# Altium schematic sheet 01_SOC.SchDoc
size 297 x 209 mm; SheetNumber: 1; SheetTotal: 5; Page Create Date: March  8, 1995; Page Number: 1; Page Size: A4; Reviewer: Default; Page Count: 5; Designer: Dennis; Page Name: 01_SOC; RevCode: 1.0; DsnPath: H:\PCB\2026\狼王傻波一\20260204_V0_ELRS-RX\ELRS-RX-MODULE-V11\ELRS-RX-MODULE-V11-20260127.DSN; SchematicName: SCHEMATIC1; PageName: 01_SOC; PageSize: A4; TopSchematic: True
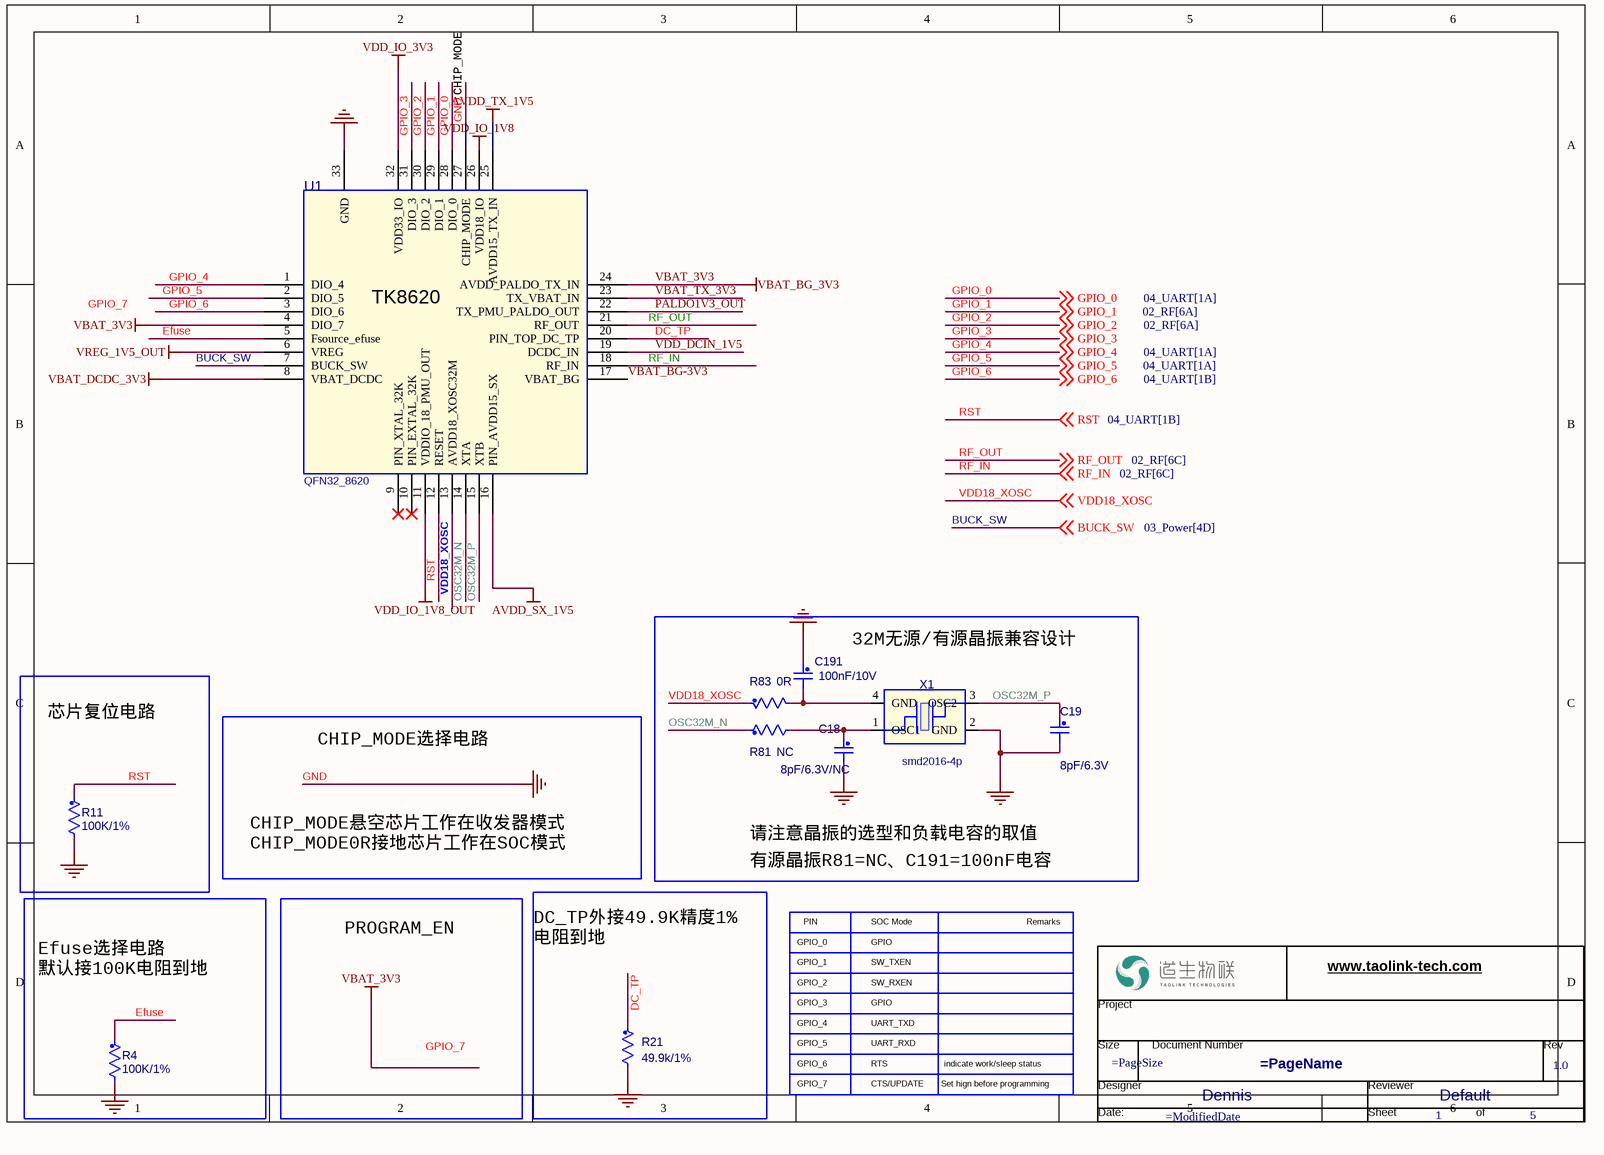
[diagram p0: 01_SOC.SchDoc]

## Parts
*  RevCode: 1.0  Designer: Dennis  Reviewer: Default  Page Number: 1  Page Count: 5  (graphical)
C18  8pF/6.3V/NC  [0201]
C19  8pF/6.3V  [0201]
C191  100nF/10V  [0201]
R4  100K/1%  [0201]
R11  100K/1%  [0201]
R21  49.9k/1%  [0201]
R81  NC  [0201]
R83  0R  [0201]
U1  TK8620  [QFN32_8620]
X1  X1E0002510059  [smd2016-4p]  (value not drawn)

## Blocks framed on the sheet
芯片复位电路: R11

## Nets
AVDD_SX_1V5: U1.16(PIN_AVDD15_SX)
AVDD_TX_1V5: U1.25(AVDD15_TX_IN)
GND: C18.2 C19.2 C191.1 R4.2 R11.2 R21.2 U1.27(CHIP_MODE) U1.33(GND) X1.2(GND)
VBAT_3V3: U1.4(DIO_7) U1.24(AVDD_PALDO_TX_IN)  [also labelled VBAT_BG_3V3]
VBAT_DCDC_3V3: U1.8(VBAT_DCDC)
VDD_IO_1V8: U1.26(VDD18_IO)
VDD_IO_1V8_OUT: U1.11(VDDIO_18_PMU_OUT)
VDD_IO_3V3: U1.32(VDD33_IO)
VREG_1V5_OUT: U1.6(VREG)
BUCK_SW: U1.7(BUCK_SW) ; off-sheet BUCK_SW
DC_TP: R21.1 U1.20(PIN_TOP_DC_TP)
Efuse: R4.1 U1.5(Fsource_efuse)
GPIO_0: U1.28(DIO_0) ; off-sheet GPIO_0
GPIO_1: U1.29(DIO_1) ; off-sheet GPIO_1
GPIO_2: U1.30(DIO_2) ; off-sheet GPIO_2
GPIO_3: U1.31(DIO_3) ; off-sheet GPIO_3
GPIO_4: U1.1(DIO_4) ; off-sheet GPIO_4
GPIO_5: U1.2(DIO_5) ; off-sheet GPIO_5
GPIO_6: U1.3(DIO_6) ; off-sheet GPIO_6
OSC32M_N: R81.1 U1.14(XTA)
OSC32M_P: C19.1 U1.15(XTB) X1.3(OSC2)
PALDO1V3_OUT: U1.22(TX_PMU_PALDO_OUT)
RF_IN: U1.18(RF_IN) ; off-sheet RF_IN
RF_OUT: U1.21(RF_OUT) ; off-sheet RF_OUT
RST: R11.1 U1.12(RESET) ; off-sheet RST
VBAT_BG-3V3: U1.17(VBAT_BG)
VBAT_TX_3V3: U1.23(TX_VBAT_IN)
VDD18_XOSC: R83.1 U1.13(AVDD18_XOSC32M) ; off-sheet VDD18_XOSC
VDD_DCIN_1V5: U1.19(DCDC_IN)
NetC18_1: C18.1 R81.2 X1.1(OSC1)
NetC191_2: C191.2 R83.2 X1.4(GND)

Not connected (* = marked no-connect by the designer): U1 9(PIN_XTAL_32K)* 10(PIN_EXTAL_32K)*

## Notes on the sheet
- CHIP_MODE
- 32M无源/有源晶振兼容设计
- CHIP_MODE选择电路
- CHIP_MODE悬空芯片工作在收发器模式
  CHIP_MODE0R接地芯片工作在SOC模式
- 请注意晶振的选型和负载电容的取值
- 有源晶振R81=NC、C191=100nF电容
- PROGRAM_EN
- DC_TP外接49.9K精度1%
  电阻到地
- GPIO_0
- PIN
- SOC Mode
- GPIO
- (near *) Remarks
- Efuse选择电路
  默认接100K电阻到地
- GPIO_1
- GPIO_2
- GPIO_3
- SW_RXEN
- SW_TXEN
- GPIO_4
- GPIO_5
- GPIO_6
- RTS
- UART_TXD
- UART_RXD
- indicate work/sleep status
- GPIO_7
- CTS/UPDATE
- Set hign before programming
- Labels drawn without touching a wire or pin: GPIO_7
- (in symbol TaoLin_DesignName) www.taolink-tech.com; Project; Size; Document Number; Rev; Designer; Reviewer; Date:; Sheet; of

## Library data of the parts
* = TaoLin_DesignName: Page Create Date: March  8, 1995; Page Size: =PageSize; Page Name: =PageName; Page Modify Date: =ModifiedDate
C18 = Ceramic Capacitor: Ceramic Capacitor,22uF,6.3V,+/-20%,X5R,0603,Samsung; Part Reference: C18; Manufacturer P/N: CL10A226MQ8NRNC; Myir P/N: 20401.00086; Value: 8pF/6.3V/NC; PCB Footprint: 0201; Datasheet: Samsung.pdf; Reserve Value: 22uF; Manufacturer: Samsung; Part Type: Ceramic Capacitor
C19 = Ceramic Capacitor: Ceramic Capacitor,22uF,6.3V,+/-20%,X5R,0603,Samsung; Part Reference: C19; Manufacturer P/N: CL10A226MQ8NRNC; Myir P/N: 20401.00086; Value: 8pF/6.3V; PCB Footprint: 0201; Part Type: Ceramic Capacitor; Manufacturer: Samsung; Reserve Value: 22uF; Datasheet: Samsung.pdf
C191 = Ceramic Capacitor: Ceramic Capacitor,22uF,6.3V,+/-20%,X5R,0603,Samsung; Part Reference: C191; Manufacturer P/N: CL10A226MQ8NRNC; Myir P/N: 20401.00086; Value: 100nF/10V; PCB Footprint: 0201; Datasheet: Samsung.pdf; Reserve Value: 22uF; Manufacturer: Samsung; Part Type: Ceramic Capacitor
R4 = Resister: Thick Film Resistor,0R,+/-5%,1/16W,-55°C ~ 155°C,SMD,0402,Fenghua; Part Reference: R4; Manufacturer P/N: RC-02000JT; Myir P/N: 20301.00186; Value: 100K/1%; PCB Footprint: 0201; Datasheet: FH规格书_2018-07-30.pdf; Reserve Value: 0R; Manufacturer: Fenghua; Part Type: Thick Film Resistor
R11 = Resister: Thick Film Resistor,0R,+/-5%,1/16W,-55°C ~ 155°C,SMD,0402,Fenghua; Part Reference: R11; Manufacturer P/N: RC-02000JT; Myir P/N: 20301.00186; Value: 100K/1%; PCB Footprint: 0201; Datasheet: FH规格书_2018-07-30.pdf; Reserve Value: 0R; Manufacturer: Fenghua; Part Type: Thick Film Resistor
R21 = Resister: Thick Film Resistor,0R,+/-5%,1/16W,-55°C ~ 155°C,SMD,0402,Fenghua; Part Reference: R21; Manufacturer P/N: RC-02000JT; Myir P/N: 20301.00186; Value: 49.9k/1%; PCB Footprint: 0201; Part Type: Thick Film Resistor; Manufacturer: Fenghua; Reserve Value: 0R; Datasheet: FH规格书_2018-07-30.pdf
R81 = Resister: Thick Film Resistor,0R,+/-5%,1/16W,-55°C ~ 155°C,SMD,0402,Fenghua; Part Reference: R81; Manufacturer P/N: RC-02000JT; Myir P/N: 20301.00186; Value: NC; PCB Footprint: 0201; Part Type: Thick Film Resistor; Manufacturer: Fenghua; Reserve Value: 0R; Datasheet: FH规格书_2018-07-30.pdf
R83 = Resister: Thick Film Resistor,0R,+/-5%,1/16W,-55°C ~ 155°C,SMD,0402,Fenghua; Part Reference: R83; Manufacturer P/N: RC-02000JT; Myir P/N: 20301.00186; Value: 0R; PCB Footprint: 0201; Part Type: Thick Film Resistor; Manufacturer: Fenghua; Reserve Value: 0R; Datasheet: FH规格书_2018-07-30.pdf
U1 = K2201A_3: Part Reference: U1; Value: TK8620; PCB Footprint: QFN32_8620
X1 = Crystal_32M: Part Reference: X1; Value: X1E0002510059; PCB Footprint: smd2016-4p